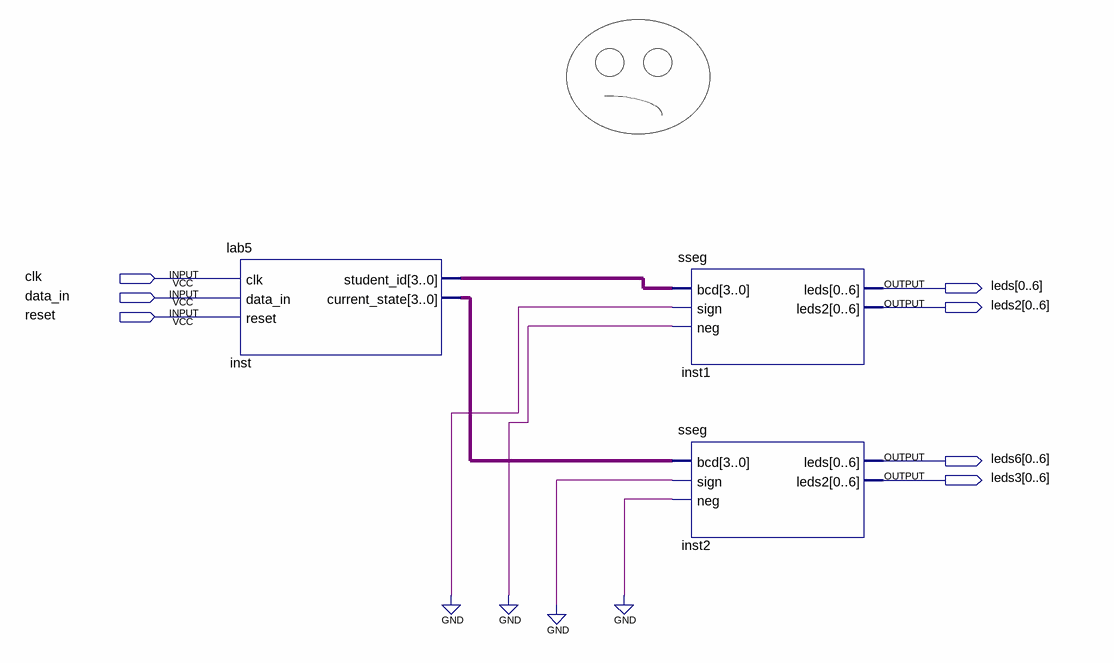
[diagram p0: schematic sheet]
// Quartus schematic combination.bdf as structural Verilog: 3 symbols, 7 pins
module combination (
  input  clk,
  input  data_in,
  input  reset,
  output [0:6] leds,
  output [0:6] leds2,
  output [0:6] leds6,
  output [0:6] leds3
);

  wire [3:0] inst_current_state, inst_student_id;

  lab5 inst (
    .clk(clk), .data_in(data_in), .reset(reset), .student_id(inst_student_id),
    .current_state(inst_current_state));
  sseg inst1 (.bcd(inst_student_id), .sign(1'b0), .neg(1'b0), .leds(leds), .leds2(leds2));
  sseg inst2 (.bcd(inst_current_state), .sign(1'b0), .neg(1'b0), .leds(leds6), .leds2(leds3));
endmodule
